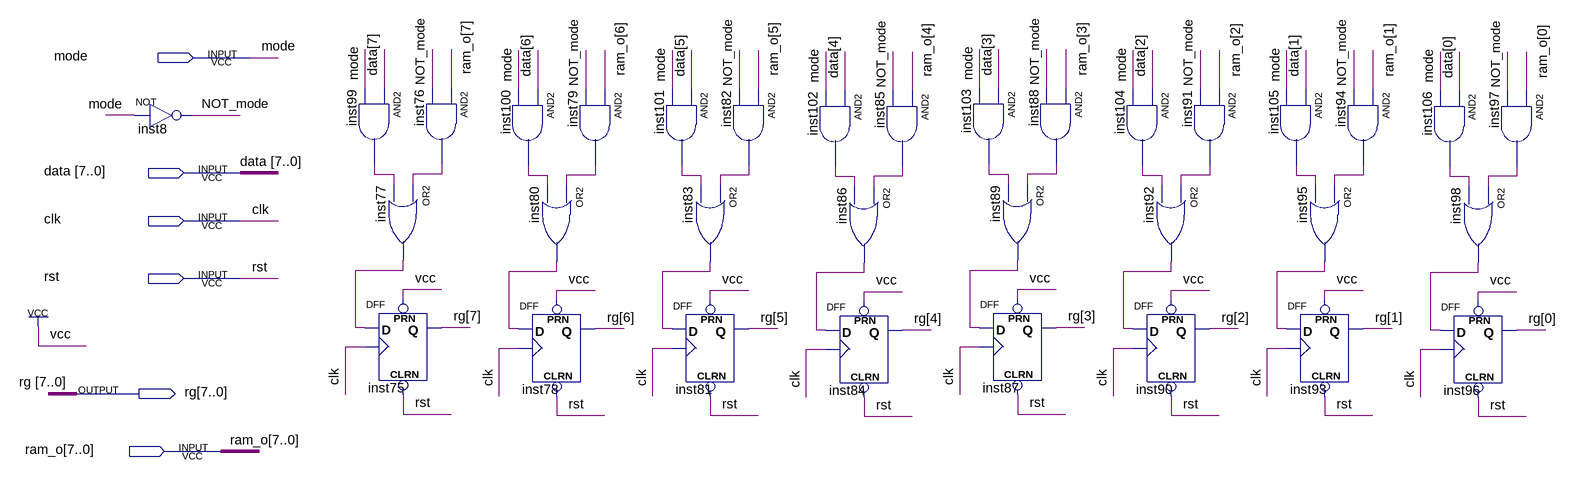
[diagram p0: schematic sheet]
// Quartus schematic Block1.bdf as structural Verilog: 33 symbols, 6 pins
module Block1 (
  input  mode,
  input  [7:0] data,
  input  clk,
  input  rst,
  input  [7:0] ram_o,
  output [7:0] rg
);

  wire inst76_out, inst77_out, inst79_out, inst80_out, inst82_out, inst83_out, inst85_out, inst86_out,
       inst88_out, inst89_out, inst91_out, inst92_out, inst94_out, inst95_out, inst97_out, inst98_out,
       inst99_out, inst100_out, inst101_out, inst102_out, inst103_out, inst104_out, inst105_out, inst106_out,
       NOT_mode;

  not inst8 (NOT_mode, mode);
  and inst99 (inst99_out, data[7], mode);
  and inst76 (inst76_out, ram_o[7], NOT_mode);
  or inst77 (inst77_out, inst76_out, inst99_out);
  DFF inst75 (.CLRN(rst), .CLK(clk), .D(inst77_out), .PRN(1'b1), .Q(rg[7]));
  and inst100 (inst100_out, data[6], mode);
  and inst79 (inst79_out, ram_o[6], NOT_mode);
  or inst80 (inst80_out, inst79_out, inst100_out);
  DFF inst78 (.CLRN(rst), .CLK(clk), .D(inst80_out), .PRN(1'b1), .Q(rg[6]));
  and inst101 (inst101_out, data[5], mode);
  and inst82 (inst82_out, ram_o[5], NOT_mode);
  or inst83 (inst83_out, inst82_out, inst101_out);
  DFF inst81 (.CLRN(rst), .CLK(clk), .D(inst83_out), .PRN(1'b1), .Q(rg[5]));
  and inst102 (inst102_out, data[4], mode);
  and inst85 (inst85_out, ram_o[4], NOT_mode);
  or inst86 (inst86_out, inst85_out, inst102_out);
  DFF inst84 (.CLRN(rst), .CLK(clk), .D(inst86_out), .PRN(1'b1), .Q(rg[4]));
  and inst103 (inst103_out, data[3], mode);
  and inst88 (inst88_out, ram_o[3], NOT_mode);
  or inst89 (inst89_out, inst88_out, inst103_out);
  DFF inst87 (.CLRN(rst), .CLK(clk), .D(inst89_out), .PRN(1'b1), .Q(rg[3]));
  and inst104 (inst104_out, data[2], mode);
  and inst91 (inst91_out, ram_o[2], NOT_mode);
  or inst92 (inst92_out, inst91_out, inst104_out);
  DFF inst90 (.CLRN(rst), .CLK(clk), .D(inst92_out), .PRN(1'b1), .Q(rg[2]));
  and inst105 (inst105_out, data[1], mode);
  and inst94 (inst94_out, ram_o[1], NOT_mode);
  or inst95 (inst95_out, inst94_out, inst105_out);
  DFF inst93 (.CLRN(rst), .CLK(clk), .D(inst95_out), .PRN(1'b1), .Q(rg[1]));
  and inst106 (inst106_out, data[0], mode);
  and inst97 (inst97_out, ram_o[0], NOT_mode);
  or inst98 (inst98_out, inst97_out, inst106_out);
  DFF inst96 (.CLRN(rst), .CLK(clk), .D(inst98_out), .PRN(1'b1), .Q(rg[0]));
endmodule
